# Altium schematic sheet LPCB235 - BRAKE LIMIT SW.SchDoc
size A3; Address1: Unit 4; DocumentNumber: 8; Revision: 2; SheetNumber: 8; SheetTotal: 37; Lockie__PCB_SUB_ASSEMBLY: Brake Limit Switches; Lockie__PCB_ASSEMBLY: FCU PCB; Lockie__LDL: LPCB235; Lockie__PCB_DESCRIPTION: Flight Control Unit
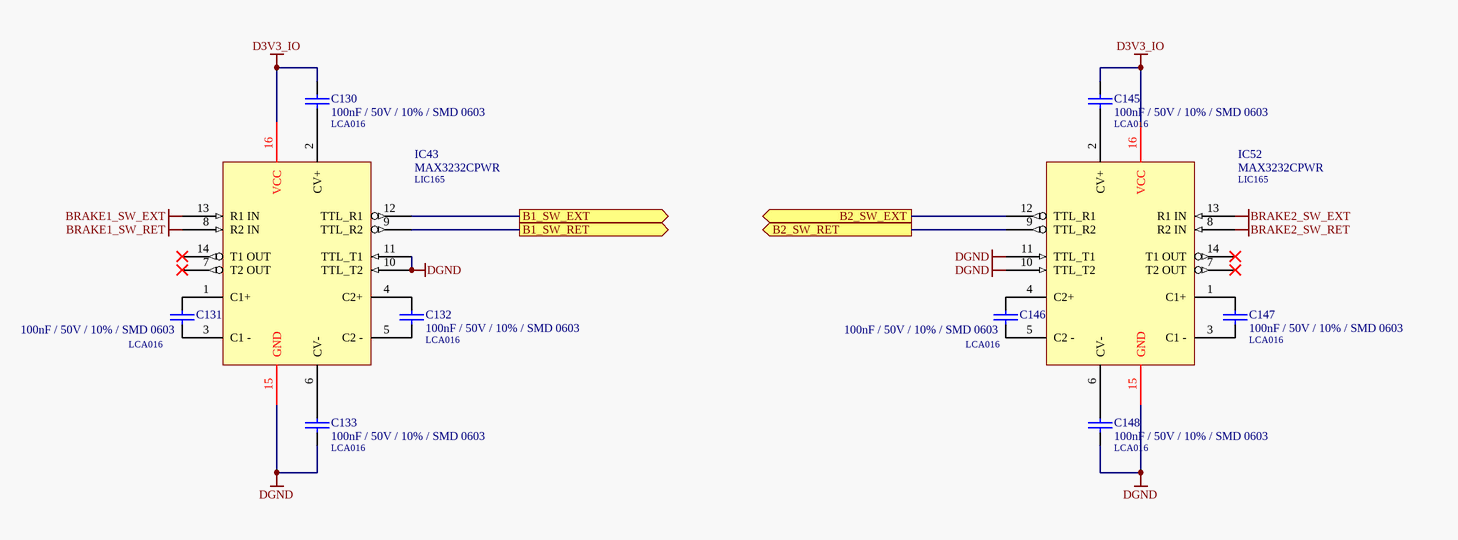
[diagram p0: LPCB235 - BRAKE LIMIT SW.SchDoc]

## Parts
C130  100nF / 50V / 10% / SMD 0603  LDL_NUMBER: LCA016  [LFP011__CC1608-0603-IPC7351_B]
C131  100nF / 50V / 10% / SMD 0603  LDL_NUMBER: LCA016  [LFP011__CC1608-0603-IPC7351_B]
C132  100nF / 50V / 10% / SMD 0603  LDL_NUMBER: LCA016  [LFP011__CC1608-0603-IPC7351_B]
C133  100nF / 50V / 10% / SMD 0603  LDL_NUMBER: LCA016  [LFP011__CC1608-0603-IPC7351_B]
C145  100nF / 50V / 10% / SMD 0603  LDL_NUMBER: LCA016  [LFP011__CC1608-0603-IPC7351_B]
C146  100nF / 50V / 10% / SMD 0603  LDL_NUMBER: LCA016  [LFP011__CC1608-0603-IPC7351_B]
C147  100nF / 50V / 10% / SMD 0603  LDL_NUMBER: LCA016  [LFP011__CC1608-0603-IPC7351_B]
C148  100nF / 50V / 10% / SMD 0603  LDL_NUMBER: LCA016  [LFP011__CC1608-0603-IPC7351_B]
IC43  MAX3232CPWR  LDL_NUMBER: LIC165  [LFP049__TSSOP-16]
IC52  MAX3232CPWR  LDL_NUMBER: LIC165  [LFP049__TSSOP-16]

## Ports
B1_SW_EXT (out), B1_SW_RET (out), B2_SW_EXT (out), B2_SW_RET (out)

## Nets
BRAKE1_SW_EXT: IC43.13(R1_IN)
BRAKE1_SW_RET: IC43.8(R2_IN)
BRAKE2_SW_EXT: IC52.13(R1_IN)
BRAKE2_SW_RET: IC52.8(R2_IN)
D3V3_IO: C130.1 C145.1 IC43.16(VCC) IC52.16(VCC)
DGND: C133.2 C148.2 IC43.10(TTL_T2) IC43.11(TTL_T1) IC43.15(GND) IC52.10(TTL_T2) IC52.11(TTL_T1) IC52.15(GND)
B1_SW_EXT: IC43.12(TTL_R1) ; port B1_SW_EXT
B1_SW_RET: IC43.9(TTL_R2) ; port B1_SW_RET
B2_SW_EXT: IC52.12(TTL_R1) ; port B2_SW_EXT
B2_SW_RET: IC52.9(TTL_R2) ; port B2_SW_RET
NetC130_2: C130.2 IC43.2(CV+)
NetC131_1: C131.1 IC43.1(C1+)
NetC131_2: C131.2 IC43.3(C1_-)
NetC132_1: C132.1 IC43.4(C2+)
NetC132_2: C132.2 IC43.5(C2_-)
NetC133_1: C133.1 IC43.6(CV-)
NetC145_2: C145.2 IC52.2(CV+)
NetC146_1: C146.1 IC52.4(C2+)
NetC146_2: C146.2 IC52.5(C2_-)
NetC147_1: C147.1 IC52.1(C1+)
NetC147_2: C147.2 IC52.3(C1_-)
NetC148_1: C148.1 IC52.6(CV-)

Not connected (* = marked no-connect by the designer): IC43 7(T2_OUT)* 14(T1_OUT)*; IC52 7(T2_OUT)* 14(T1_OUT)*

## Notes on the sheet
- PCB COMPONENT DESCRIPTION
- LDL NUMBER
- Assembly Details
- Size
- Drawing File Name
- Revision
- http://rloop.org
- Scale
- A3
- Sheet Details
- N.T.S
- Sheet:
- Of:

## Library data of the parts
C130-C133 C145-C148 = 100nF / 50V / 10% / SMD 0603: Capacitor, Ceramic Chip, 100nF (0.1uF), 50V, 5%, SMD 0603 [LCA016]; Value: 100n; FMEDA__OPERATING__VOLTAGE_MIN: 0; FMEDA__OPERATING__VOLTAGE_MAX: 3.3; FMEDA__OPERATING__TEMP_MIN: -20; FMEDA__OPERATING__TEMP_TYP: 27; FMEDA__OPERATING__TEMP_MAX: 50; FMEDA__CHANNEL: COM; FMEDA__FUNCTION_IN_SYSTEM: *; FMEDA__OPERATING__VOLTAGE_TYP: 3.3
IC43 = MAX3232CPWR: IC, RS232 Line Driver, 3.3V, SMD TSSOP16 [LIC165]; FMEDA__OPERATING__TEMP_MAX: 50; FMEDA__OPERATING__TEMP_MIN: -20; FMEDA__OPERATING__TEMP_TYP: 27; FMEDA__CHANNEL: COM; FMEDA__OPERATING__VOLTAGE_MAX: 3.3; FMEDA__OPERATING__VOLTAGE_MIN: 0; FMEDA__FUNCTION_IN_SYSTEM: *; FMEDA__OPERATING__VOLTAGE_TYP: 3.3
IC52 = MAX3232CPWR: IC, RS232 Line Driver, 3.3V, SMD TSSOP16; FMEDA__OPERATING__TEMP_MAX: 50; FMEDA__OPERATING__TEMP_MIN: -20; FMEDA__OPERATING__TEMP_TYP: 27; FMEDA__CHANNEL: COM; FMEDA__OPERATING__VOLTAGE_MAX: 3.3; FMEDA__OPERATING__VOLTAGE_MIN: 0; FMEDA__FUNCTION_IN_SYSTEM: *; FMEDA__OPERATING__VOLTAGE_TYP: 3.3